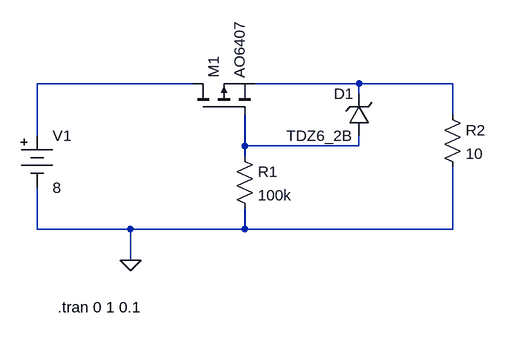
[diagram p0: schematic reverse_pol.asc]
reverse_pol.asc, the LTspice schematic file:
Version 4
SHEET 1 880 680
WIRE 384 160 144 160
WIRE 640 160 480 160
WIRE 784 160 640 160
WIRE 640 176 640 160
WIRE 784 208 784 160
WIRE 144 240 144 160
WIRE 464 256 464 208
WIRE 640 256 640 240
WIRE 640 256 464 256
WIRE 464 272 464 256
WIRE 144 384 144 320
WIRE 288 384 144 384
WIRE 464 384 464 352
WIRE 464 384 288 384
WIRE 784 384 784 288
WIRE 784 384 464 384
WIRE 288 432 288 384
FLAG 288 432 0
SYMBOL pmos 384 208 R270
SYMATTR InstName M1
SYMATTR Value AO6407
SYMBOL res 448 256 R0
SYMATTR InstName R1
SYMATTR Value 100k
SYMBOL res 768 192 R0
SYMATTR InstName R2
SYMATTR Value 10
SYMBOL Misc/battery 144 224 R0
SYMATTR InstName V1
SYMATTR Value 8
SYMBOL zener 656 240 R180
WINDOW 0 24 64 Left 2
WINDOW 3 24 0 Left 2
SYMATTR InstName D1
SYMATTR Value TDZ6_2B
SYMATTR Description Diode
SYMATTR Type diode
TEXT 176 504 Left 2 !.tran 0 1 0.1

The netlist it stands for:
* reverse_pol.asc
M1 N001 N003 N002 N002 AO6407
R1 N003 0 100k
R2 N002 0 10
V1 N001 0 8
D1 N003 N002 TDZ6_2B
.model D D
.lib standard.dio
.model NMOS NMOS
.model PMOS PMOS
.lib standard.mos
.tran 0 1 0.1
.backanno
.end